# Altium schematic sheet 5V_DC-DC_PowerSupply.SchDoc
size Letter
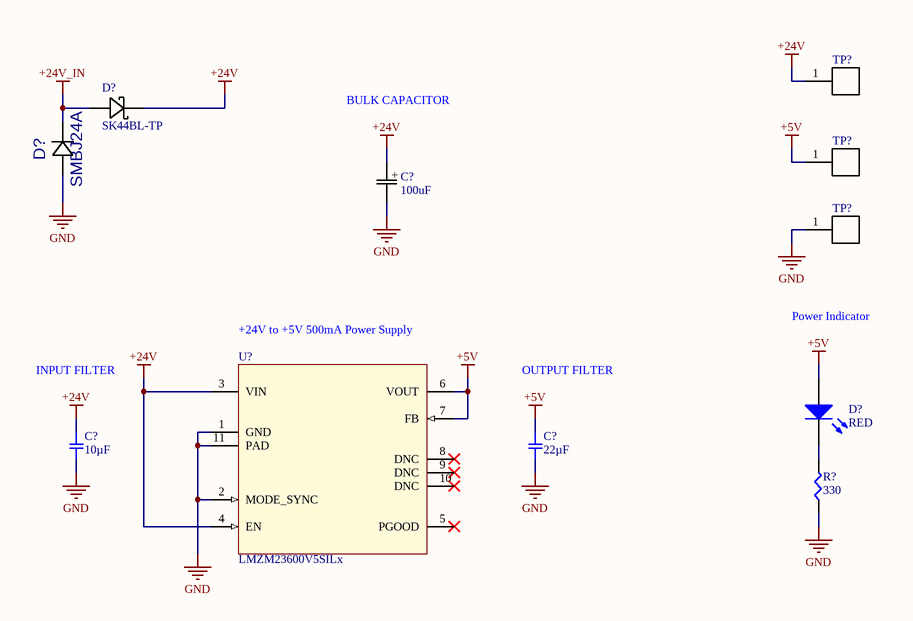
[diagram p0: 5V_DC-DC_PowerSupply.SchDoc]

## Parts
(Parts that share a designator on the sheet are numbered #1, #2 ... from top to bottom, then left to right.)
C?#1  100uF  [Capacitor SMD 6.6mm]
C?#2  10µF  [SMD-1206C]
C?#3  22µF  [SMD-0805C]
D?#1  SK44BL-TP  [SMB]
D?#2  SMBJ24A  [SMB]
D?#3  RED  [LED_603]
R?  330  [SMD-0603-RES]
TP?#1  +24V  [TE_RCU-0C]  (value not drawn)
TP?#2  +5V  [TE_RCU-0C]  (value not drawn)
TP?#3  GND  [TE_RCU-0C]  (value not drawn)
U?  LMZM23600V5SILx  [LMZM23600V5SILx]

## Nets
+5V: C?#3.1 D?#3.1(A) TP?#2.1 U?.6(VOUT) U?.7(FB)
+24V: C?#1.1 C?#2.1 D?#1.1 TP?#1.1 U?.3(VIN) U?.4(EN)
+24V_IN: D?#1.2 D?#2.1
GND: C?#1.2 C?#2.2 C?#3.2 D?#2.2 R?.1 TP?#3.1 U?.1(GND) U?.2(MODE_SYNC) U?.11(PAD)
NetD?#3_2: D?#3.2(K) R?.2

Not connected (* = marked no-connect by the designer): U? 5(PGOOD)* 8(DNC)* 9(DNC)* 10(DNC)*

## Notes on the sheet
- BULK CAPACITOR
- +24V to +5V 500mA Power Supply
- Power Indicator
- INPUT FILTER
- OUTPUT FILTER
- (in symbol Capacitor SMD 6.6mm) +

## Library data of the parts
C?#1 = Capacitor SMD 6.6mm
C?#2 = GRM31CR61H106KA12L: CAP CER 10UF 50V X5R 1206; Manufacturer: Murata Electronics North America; Factory Stock: 0; Unit Price (USD): 0.65; Minimum Quantity: 1; Tolerance: ±10%; Datasheets: http://www.murata.com/~/media/webrenewal/support/library/catalog/products/capacitor/mlcc/c02e.pdf; Image: //media.digikey.com/Renders/Murata%20Renders/GR331BD72E473KW01L.jpg; Digi-Key Part Number: 490-5961-1-ND; Part Number: GRM31CR61H106KA12L; Quantity Available: 86736; @ qty: 0; Packaging: Cut Tape (CT); Series: GRM; Part Status: Active; Value: 10µF; Voltage: 50V; Temperature Coefficient: X5R; Operating Temperature: -55°C ~ 85°C; Features: -; Ratings: -; Applications: General Purpose; Mounting Type: Surface Mount, MLCC; Package / Case: 1206 (3216 Metric); Size / Dimension: 0.126" L x 0.063" W (3.20mm x 1.60mm); Height - Seated (Max): -; Thickness (Max): 0.071" (1.80mm); Lead Spacing: -; Lead Style: -
C?#3 = GRT21BR60J226ME13L: CAP CER 22UF 6.3V X5R 0805; Manufacturer: Murata Electronics North America; Factory Stock: 0; Unit Price (USD): 0.37; Minimum Quantity: 1; Tolerance: ±20%; Datasheets: http://search.murata.co.jp/Ceramy/image/img/A01X/G101/ENG/GRT21BR60J226ME13-01.pdf; Image: //media.digikey.com/Renders/Murata%20Renders/GRT%20Series%200805(2012%20Metric).jpg; Digi-Key Part Number: 490-12366-1-ND; Part Number: GRT21BR60J226ME13L; Quantity Available: 1436; @ qty: 0; Packaging: Cut Tape (CT); Series: GRT; Part Status: Active; Value: 22µF; Voltage: 6.3V; Temperature Coefficient: X5R; Operating Temperature: -55°C ~ 85°C; Features: -; Ratings: AEC-Q200; Applications: Automotive; Mounting Type: Surface Mount, MLCC; Package / Case: 0805 (2012 Metric); Size / Dimension: 0.079" L x 0.049" W (2.00mm x 1.25mm); Height - Seated (Max): -; Thickness (Max): 0.057" (1.45mm); Lead Spacing: -; Lead Style: -
D?#2 = SMBJ24A: C: Copyright (C) 2015 Accelerated Designs. All rights reserved; Vendor: Bourns Electronics; Built_By: EMA_UL_Team; Manufacturer_Part_Number: SMBJ24A; Value: SMBJ24A
D?#3 = LED_603
R? = ERJ-3EKF3300V: RES SMD 330 OHM 1% 1/10W 0603; Manufacturer: Panasonic Electronic Components; Factory Stock: 0; Unit Price (USD): 0.00379; @ qty: 1500; Minimum Quantity: 1; Power (Watts): 0.1W, 1/10W; Temperature Coefficient: ±100ppm/°C; Part Number: ERJ-3EKF3300V; Datasheets: http://industrial.panasonic.com/www-cgi/jvcr13pz.cgi?E+PZ+3+AOA0002+ERJ3EKF3300V+7+WW; Image: //media.digikey.com/Photos/Panasonic%20Photos/MFG_ERJ-P6W%20Series.jpg; Digi-Key Part Number: P330HCT-ND; Quantity Available: 670984; Packaging: Cut Tape (CT); Series: ERJ; Part Status: Active; Value: 330; Tolerance: ±1%; Composition: Thick Film; Features: Automotive AEC-Q200; Operating Temperature: -55°C ~ 155°C; Package / Case: 0603 (1608 Metric); Supplier Device Package: 0603; Size / Dimension: 0.063" L x 0.031" W (1.60mm x 0.80mm); Height - Seated (Max): 0.022" (0.55mm); Number of Terminations: 2; Failure Rate: -
TP?#1-TP?#3 = RCU-0C: 0603 PROBE PAD; Power_Rating: 0 W; Resistance: <.05; MF: TE Connectivity; Tolerance: 0%; Digi-Key_Part_Number: A106145CT-ND; EU_RoHS_Compliance: Compliant; Digi-Key_Purchase_URL: https://www.digikey.com/product-detail/en/te-connectivity-amp-connectors/RCU-0C/A106145CT-ND/3477802?utm_source=snapeda&utm_medium=aggregator&utm_campaign=symbol; SnapEDA_Link: https://www.snapeda.com/parts/RCU-0C/TE%20Connectivity%20AMP%20Connectors/view-part/?ref=snap; Link: http://www.te.com/usa-en/product-1625854-3.html; MP: RCU-0C; Package: 0603; Value: *
U? = LMZM23600V5SILx: PWR MGMT SWITCHING REGULATOR / Manufacturer PN: LMZM23600V5SILR